# EasyEDA schematic Siren Amp.json
TITLE: Siren Amp and Rumbler Divider; REV: 1.0; Date: 2018-07-05; Sheet: 1/1; Drawn By: JKoppenhaver
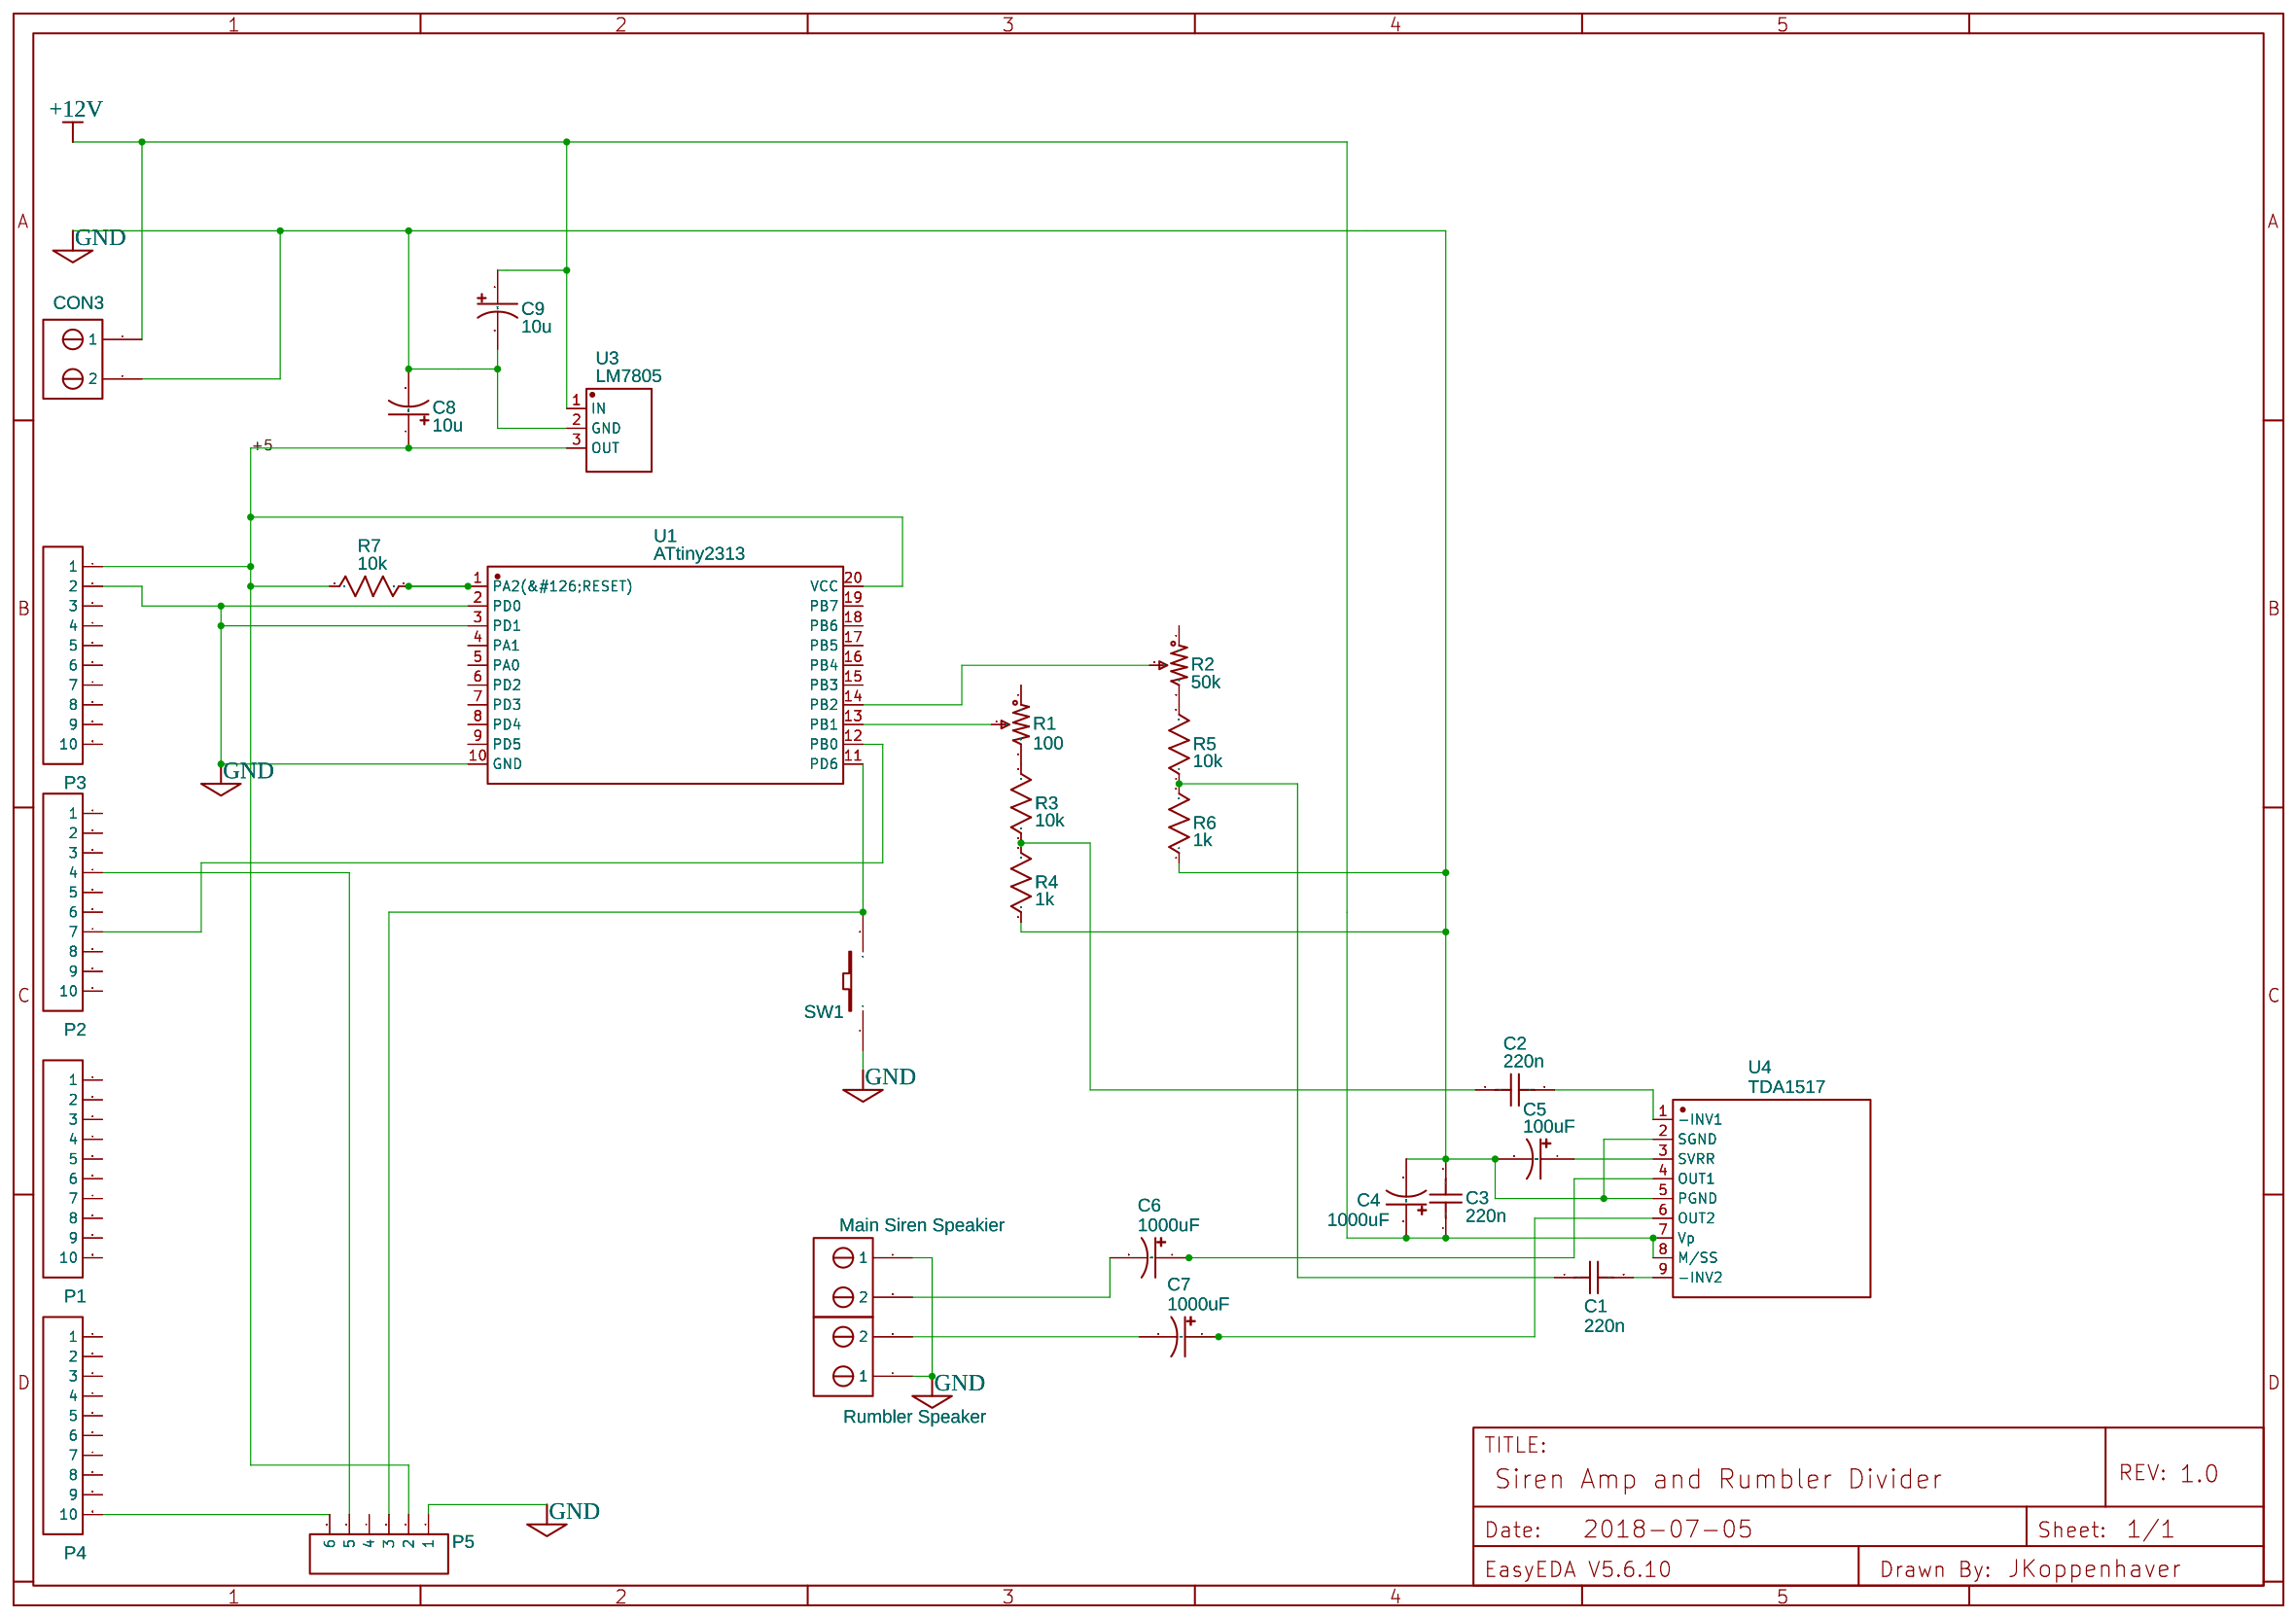
[diagram p0: schematic sheet]

## Parts
C1  220n  [RAD-0.1]
C2  220n  [RAD-0.1]
C3  220n  [RAD-0.1]
C4  1000uF  [CAPACITOR 10MM]
C5  100uF  [CAP-D3.0XF1.5]
C6  1000uF  [CAPACITOR 10MM]
C7  1000uF  [CAPACITOR 10MM]
C8  10u  [CAP-D3.0XF1.5]
C9  10u  [CAP-D3.0XF1.5]
CON1  Main Siren Speakier  [TBLOCK SOCKET FEMALE 2P - 3.5MM]
CON2  Rumbler Speaker  [TBLOCK SOCKET FEMALE 2P - 3.5MM]
CON3  TBLOCK Connector 2P 3.5mm Pitch  [TBLOCK SOCKET FEMALE 2P - 3.5MM]
P1  Header-Female-2.54_1x10  [HDR-10X1/2.54]
P2  Header-Female-2.54_1x10  [HDR-10X1/2.54]
P3  Header-Female-2.54_1x10  [HDR-10X1/2.54]
P4  Header-Female-2.54_1x10  [HDR-10X1/2.54]
P5  Header-Male-2.54_1x6  [HDR-6X1/2.54]
R1  100  [POTENTIOMETER_WIREPADS_SMALL]
R2  50k  [POTENTIOMETER_WIREPADS_SMALL]
R3  10k  [AXIAL-0.3]
R4  1k  [AXIAL-0.3]
R5  10k  [AXIAL-0.3]
R6  1k  [AXIAL-0.3]
R7  10k  [AXIAL-0.3]
SW1  EVQ22705R  [GWB_PUSH_BUTTON]
U1  ATtiny2313  [SOCKET-20]
U3  LM7805  [TO-220(TO-220-3)]
U4  TDA1517  [SIP-9]

## Library data of the parts
C1-C3 = Cap_RAD-0.1_US: Manufacturer Part: ?
C4-C9 = Cap_Electrolytic(TH)_D3.0XF1.5_US: Manufacturer Part: ?
CON1-CON3 = -: Contributor: vinicius.avila.jorge; sourceId: bgQca86Tf; Manufacturer Part: ?
P1-P4 = -: Supplier: LCSC; Manufacturer: BOOMELE; Manufacturer Part: 2.54mm 1*10P Straight Female header Gold-plated; Contributor: LCSC; Supplier Part: C35445
P5 = -: Supplier: LCSC; Manufacturer: BOOMELE; Contributor: LCSC; Supplier Part: C37208
R1 R2 = 3386P-1-101LF_US: Supplier: LCSC; Manufacturer: Bochen; Manufacturer Part: 3386P-1-101LF; Contributor: EasyEDA; Supplier Part: C125022
R3-R7 = Res_AXIAL-0.3(1/8W)_US: Manufacturer Part: ?
SW1 = -: Supplier: LCSC; Manufacturer: PANASONIC; Contributor: LCSC; Supplier Part: C79156
U1 U4 = -: Manufacturer Part: ?
U3 = -: Supplier: LCSC; Manufacturer: TI; Manufacturer Part: LM7805CT/NOPB; Supplier Part: C50931

## Nets
+12V: C3.1 C4.1 C9.1 CON3.1 U3.1(IN) U4.7(Vp) U4.8(M/SS)
GND: C3.2 C4.2 C5.2 C8.2 C9.2 CON1.1 CON2.1 CON3.2 P3.2 P5.1 R4.1 R6.1 SW1.1 U1.2(PD0) U1.3(PD1) U1.10(GND) U3.2(GND) U4.2(SGND) U4.5(PGND)
+5: C8.1 P3.1 P5.2 R7.1 U1.20(VCC) U3.3(OUT)
Net-(C1-1): C1.1 R5.1 R6.2
Net-(C1-2): C1.2 U4.9(-INV2)
Net-(C2-1): C2.1 U4.1(-INV1)
Net-(C2-2): C2.2 R3.1 R4.2
Net-(C5-1): C5.1 U4.3(SVRR)
Net-(C6-1): C6.1 U4.4(OUT1)
Net-(C6-2): C6.2 CON1.2
Net-(C7-1): C7.1 U4.6(OUT2)
Net-(C7-2): C7.2 CON2.2
Net-(P2-4): P2.4 P5.5
Net-(P2-7): P2.7 U1.12(PB0)
Net-(P4-10): P4.10 P5.6
Net-(P5-3): P5.3 SW1.2 U1.11(PD6)
Net-(R1-2): R1.2 U1.13(PB1)
Net-(R1-3): R1.3 R3.2
Net-(R2-2): R2.2 U1.14(PB2)
Net-(R2-3): R2.3 R5.2
Net-(R7-2): R7.2 U1.1(PA2(&#126;RESET))

Not connected (* = marked no-connect by the designer): P1 1 2 3 4 5 6 7 8 9 10; P2 1 2 3 5 6 8 9 10; P3 3 4 5 6 7 8 9 10; P4 1 2 3 4 5 6 7 8 9; P5 4; R1 1; R2 1; U1 4(PA1) 5(PA0) 6(PD2) 7(PD3) 8(PD4) 9(PD5) 15(PB3) 16(PB4) 17(PB5) 18(PB6) 19(PB7)
